# Altium project TOF.PrjPCB
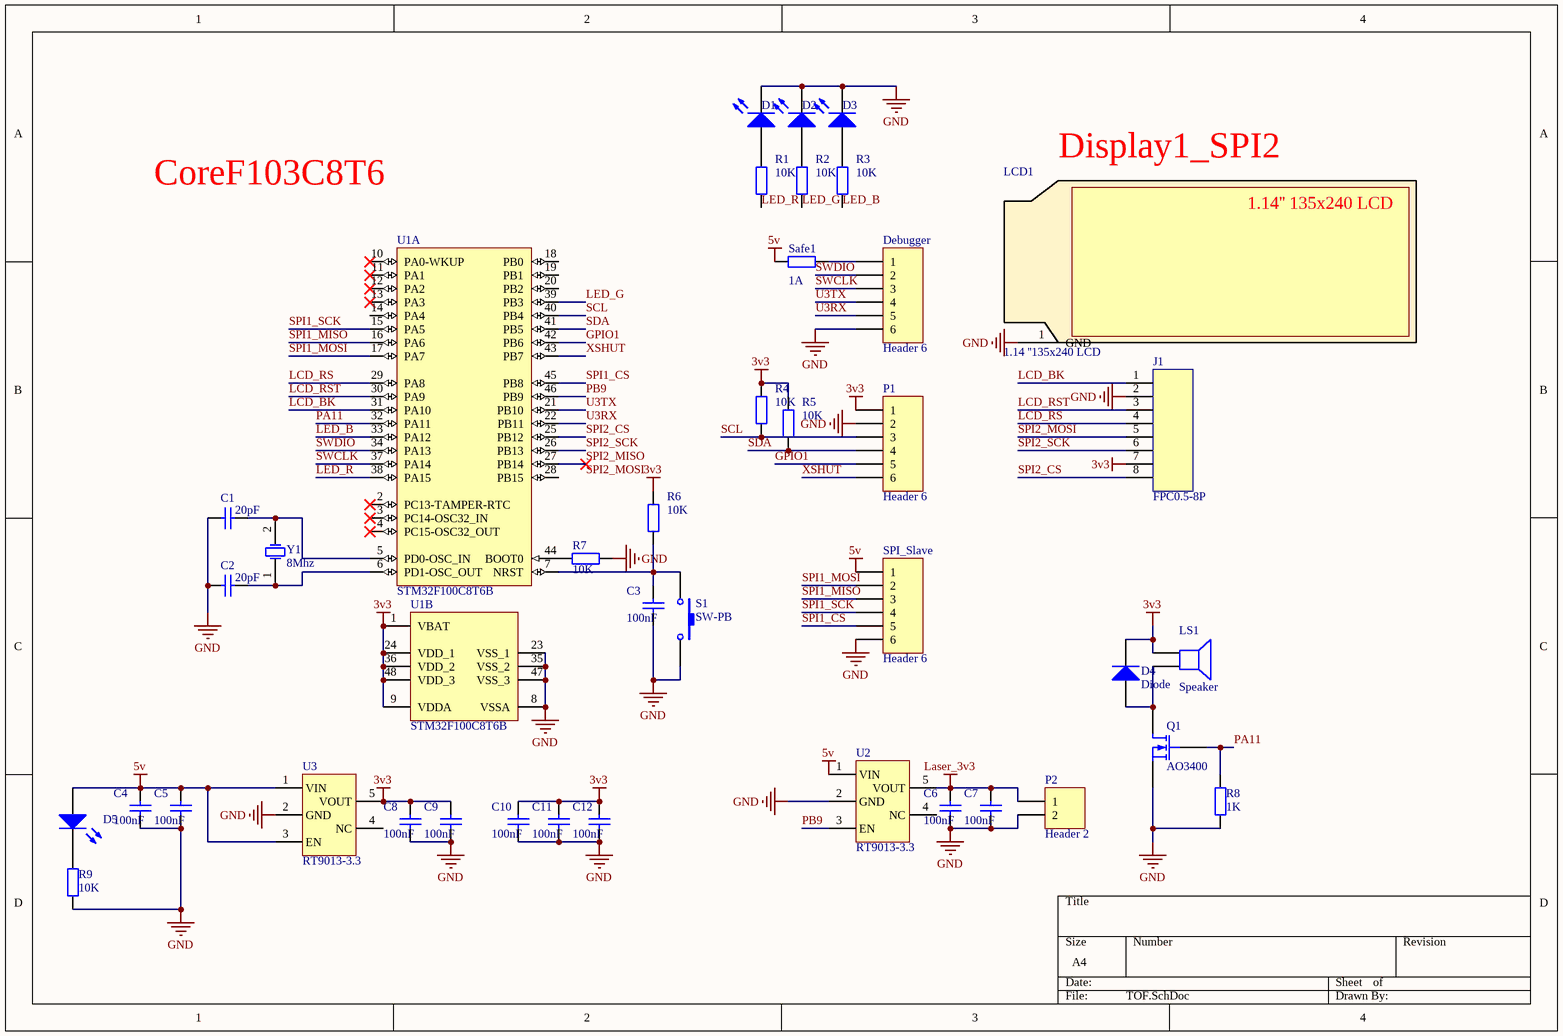
[diagram p0: TOF.SchDoc]
1 sheet, 40 parts. Net scope: global (net labels, ports and power ports of the same name join across sheets).
Board file: TOF.PcbDoc

## Sheet TOF.SchDoc
size A4

### Parts
C1  value 20pF  [0603C]  (hidden comment: Cap)
C2  value 20pF  [0603C]  (hidden comment: Cap)
C3  value 100nF  [0603C]  (hidden comment: Cap)
C4  value 100nF  [0603C]  (hidden comment: Cap)
C5  value 100nF  [0603C]  (hidden comment: Cap)
C6  value 100nF  [0603C]  (hidden comment: Cap)
C7  value 100nF  [0603C]  (hidden comment: Cap)
C8  value 100nF  [0603C]  (hidden comment: Cap)
C9  value 100nF  [0603C]  (hidden comment: Cap)
C10  value 100nF  [0603C]  (hidden comment: Cap)
C11  value 100nF  [0603C]  (hidden comment: Cap)
C12  value 100nF  [0603C]  (hidden comment: Cap)
D1  LED0  [LED-0805-Red]  (value not drawn)
D2  LED0  [0805LED]  (value not drawn)
D3  LED0  [LED-0805-Blue]  (value not drawn)
D4  Diode  [SOD-323-]
D5  LED0  [0805LED]  (value not drawn)
Debugger  Header 6  [GX1.25_T_6P]
J1  FPC0.5-8P  [FPC0.5-8P]
LCD1  1.14 ''135x240 LCD  [1.14'' LCD]
LS1  Speaker  [MLT-8530]
P1  Header 6  [HDR1X6]
P2  Header 2  [HDR1X2]
Q1  AO3400  [SOT-23]
R1  10K  [0603R]
R2  10K  [0603R]
R3  10K  [0603R]
R4  10K  [0603R]
R5  10K  [0603R]
R6  10K  [0603R]
R7  value 10K  [0603R]  (hidden comment: Res2)
R8  value 1K  [0603R]  (hidden comment: Res2)
R9  10K  [0603R]
S1  SW-PB  [Key-2*4*3.5-S]
Safe1  value 1A  [0805R]  (hidden comment: Res2)
SPI_Slave  Header 6  [GX1.25_T_6P]
U1  STM32F100C8T6B  [LQFP-48]  (parts A,B of 2)
U2  RT9013-3.3  [SOT-23-5]
U3  RT9013-3.3  [SOT-23-5]
Y1  8Mhz  [Cry-3215]

### Nets
3v3: C8.2 C9.2 C10.2 C11.2 C12.2 D4.2(K) J1.7 LS1.1 P1.1 R4.2 R5.2 R6.2 U1.1(VBAT) U1.9(VDDA) U1.24(VDD_1) U1.36(VDD_2) U1.48(VDD_3) U3.5(VOUT)
5v: C4.2 C5.2 D5.1(A) Safe1.1 SPI_Slave.1 U2.1(VIN) U3.1(VIN) U3.3(EN)
GND: C1.1 C2.1 C3.1 C4.1 C5.1 C6.1 C7.1 C8.1 C9.1 C10.1 C11.1 C12.1 D1.2(K) D2.2(K) D3.2(K) Debugger.6 J1.2 LCD1.1(GND) P1.2 P2.2 Q1.3(S) R7.1 R8.1 R9.2 S1.2 SPI_Slave.6 U1.8(VSSA) U1.23(VSS_1) U1.35(VSS_2) U1.47(VSS_3) U2.2(GND) U3.2(GND)
Laser_3v3: C6.2 C7.2 P2.1 U2.5(VOUT)
GPIO1: P1.5 U1.42(PB6)
LCD_BK: J1.1 U1.31(PA10)
LCD_RS: J1.4 U1.29(PA8)
LCD_RST: J1.3 U1.30(PA9)
LED_B: R3.1 U1.33(PA12)
LED_G: R2.1 U1.39(PB3)
LED_R: R1.1 U1.38(PA15)
PA11: Q1.2(G) R8.2 U1.32(PA11)
PB9: U1.46(PB9) U2.3(EN)
SCL: P1.3 R4.1 U1.40(PB4)
SDA: P1.4 R5.1 U1.41(PB5)
SPI1_CS: SPI_Slave.5 U1.45(PB8)
SPI1_MISO: SPI_Slave.3 U1.16(PA6)
SPI1_MOSI: SPI_Slave.2 U1.17(PA7)
SPI1_SCK: SPI_Slave.4 U1.15(PA5)
SPI2_CS: J1.8 U1.25(PB12)
SPI2_MISO: U1.27(PB14)
SPI2_MOSI: J1.5
SPI2_SCK: J1.6 U1.26(PB13)
SWCLK: Debugger.3 U1.37(PA14)
SWDIO: Debugger.2 U1.34(PA13)
U3RX: Debugger.5 U1.22(PB11)
U3TX: Debugger.4 U1.21(PB10)
XSHUT: P1.6 U1.43(PB7)
NetC1_2: C1.2 U1.5(PD0-OSC_IN) Y1.2(OSC2)
NetC2_2: C2.2 U1.6(PD1-OSC_OUT) Y1.1(OSC1)
NetC3_2: C3.2 R6.1 S1.1 U1.7(NRST)
NetD1_1: D1.1(A) R1.2
NetD2_1: D2.1(A) R2.2
NetD3_1: D3.1(A) R3.2
NetD4_1: D4.1(A) LS1.2 Q1.1(D)
NetD5_2: D5.2(K) R9.1
NetDebugger_1: Debugger.1 Safe1.2
NetR7_2: R7.2 U1.44(BOOT0)

Not connected (* = marked no-connect by the designer): U1 2(PC13-TAMPER-RTC)* 3(PC14-OSC32_IN)* 4(PC15-OSC32_OUT)* 10(PA0-WKUP)* 11(PA1)* 12(PA2)* 13(PA3)* 14(PA4) 18(PB0) 19(PB1) 20(PB2) 28(PB15); U2 4(NC); U3 4(NC)

### Notes on the sheet
- Display1_SPI2
- CoreF103C8T6
- Labels drawn without touching a wire or pin: SPI2_MOSI
- (in symbol 1.14 ''135x240 LCD) 1.14'' 135x240 LCD

### Library data of the parts
C1-C12 = Cap: Capacitor; Published: 8-Jun-2000; LatestRevisionDate: 17-Jul-2002; LatestRevisionNote: Re-released for DXP Platform.; PackageReference: RAD-0.3; Publisher: Altium Limited; PackageDescription: Radial Cap, Thru-Hole; 2 Leads; 0.3 in Pin Spacing
D1-D3 D5 = LED0: Typical INFRARED GaAs LED; Published: 8-Jun-2000; LatestRevisionDate: 08-Jul-2005; LatestRevisionNote: Mech Layer 1 removed.; PackageReference: LED-0; Publisher: Altium Limited; PackageDescription: LED; 2 Leads
D4 = Diode: Default Diode; Published: 8-Jun-2000; LatestRevisionDate: 17-Jul-2002; LatestRevisionNote: Re-released for DXP Platform.; PackageVersion: Sep-1996; PackageReference: SMC; Publisher: Altium Limited; PackageDescription: DO-214-AB/SMC; 2 C-Bend Leads; Body 7.9 x 5.9 mm, inc. leads (LxW); Code_JEDEC: DO-214-AB
Debugger P1 SPI_Slave = Header 6: Header, 6-Pin; LatestRevisionDate: 17-Jul-2002; LatestRevisionNote: Re-released for DXP Platform.; Publisher: Altium Limited
J1 = FPC0.5-8P: 贴片
LS1 = Speaker: Loudspeaker; Published: 24-Mar-1999; LatestRevisionDate: 17-Jul-2002; LatestRevisionNote: Re-released for DXP Platform.; PackageReference: PIN2; Publisher: Altium Limited
P2 = Header 2: Header, 2-Pin; LatestRevisionDate: 17-Jul-2002; LatestRevisionNote: Re-released for DXP Platform.; Publisher: Altium Limited
Q1 = MOSFET-N: N-Channel MOSFET; Published: 8-Jun-2000; LatestRevisionDate: 17-Jul-2002; LatestRevisionNote: Re-released for DXP Platform.; PackageVersion: 1995/1996; PackageReference: E3; Publisher: Altium Limited; PackageDescription: TO, Flat Index; 3 In-Line, Axial Leads; Body Dia. 4.6mm; Lead Dia. 0.5 mm (max)
R1-R9 Safe1 = Res2: Resistor; Published: 8-Jun-2000; LatestRevisionDate: 17-Jul-2002; LatestRevisionNote: Re-released for DXP Platform.; PackageReference: AXIAL-0.4; Publisher: Altium Limited; PackageDescription: Axial Device, Thru-Hole; 2 Leads; 0.4 in Pin Spacing
  R1-R6 R9: Value: 10K
S1 = SW-PB: Switch; Published: 24-Mar-1999; LatestRevisionDate: 17-Jul-2002; LatestRevisionNote: Re-released for DXP Platform.; PackageReference: SPST-2; Publisher: Altium Limited; PackageDescription: Switch; 2 Leads
U1 = STM32F100C8T6B: ARM Cortex-M3 32-bit MCU, 64 KB Flash, 8 KB Internal RAM, 37 I/Os, 48-pin LQFP, -40 to 85 degC, Tray; A/D Converter: 1x12-bit (10 Channel); D/A Converter: 2x12-bit (2 Channel); FLASH Size (Prog) (kB): 64; I/Os (High Current): 37; Internal RAM Size (kB): 8; Operating Frequency(F) (Processor speed) (MHz): 24; Supply Voltage(Vcc) min (V): 2; DatasheetVersion: Rev. 7; PackageVersion: Rev. 6, 06/2013; PackageReference: LQFP48; PackageDescription: 48-Pin Low Profile Quad Flat Package, 7 x 7 mm Body, 0.5 mm Pitch; Supplier 1: Digi-Key; Supplier Part Number 1: 497-10499-ND; Supplier 2: Farnell; Supplier Part Number 2: 1838511; Supplier 3: Newark; Supplier Part Number 3: 76R0988; Supplier 4: Mouser; Supplier Part Number 4: 511-STM32F100C8T6B; Core: ARM Cortex-M3; Packing: Tray; Mounting Technology: Surface Mount; PartNumber: STM32F100C8T6B; ComponentLink1Description: Manufacturer URL; ComponentLink1URL: http://www.st.com/web/en/home.html; ComponentLink2Description: Datasheet; ComponentLink2URL: http://www.st.com/st-web-ui/static/active/en/resource/technical/document/datasheet/CD00251732.pdf; ComponentLink3Description: Package Specification; ComponentLink3URL: http://www.st.com/st-web-ui/static/active/en/resource/technical/document/datasheet/DM00058181.pdf
U2 U3 = RT9013: 3.3V 500mA
Y1 = XTAL: Published: 8-Jun-2000; LatestRevisionDate: 17-Jul-2002; LatestRevisionNote: Re-released for DXP Platform.; PackageReference: R38; Publisher: Altium Limited; PackageDescription: Crystal, Thru-Hole; 2 Leads; Body 3.1 x 8.2 mm (Dia.xH)